# Altium schematic sheet 04-GPS.SchDoc
size A
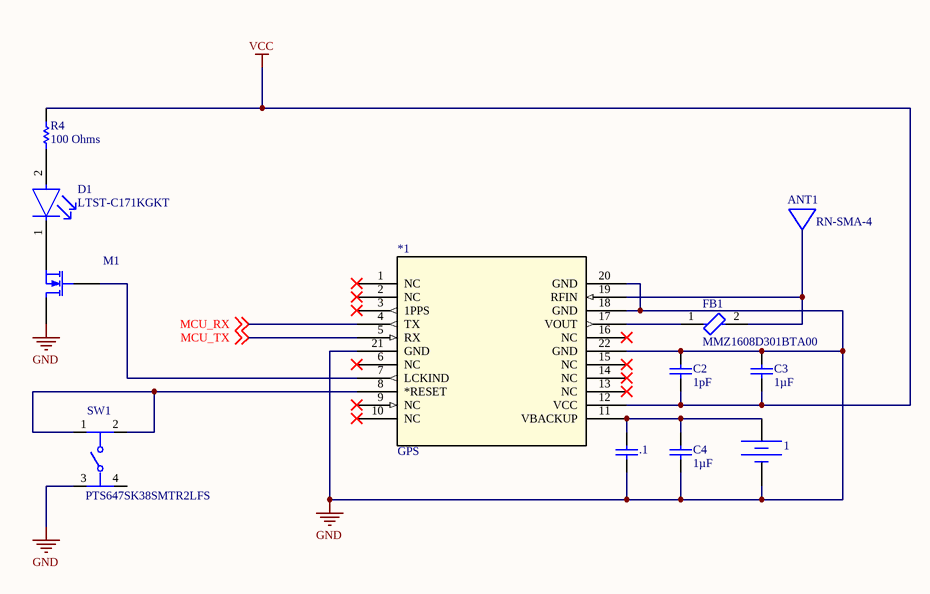
[diagram p0: 04-GPS.SchDoc]

## Parts
1  Constant Voltage Source  (value not drawn)
*1  GPS
.1  Capacitor  (value not drawn)
ANT1  RN-SMA-4  [FP-RN-SMA-4-MFG]
C2  value 1pF  (hidden comment: Capacitor)
C3  value 1µF  (hidden comment: Capacitor)
C4  value 1µF  (hidden comment: Capacitor)
D1  LTST-C171KGKT  [FP-LTST-C171KGKT-MFG]
FB1  MMZ1608D301BTA00  [FP-MMZ1608-0_8-MFG]
M1  N-chanel Power MOSFET VDMOS Model  (value not drawn)
R4  value 100 Ohms  (hidden comment: Resistor)
SW1  PTS647SK38SMTR2LFS  [FP-PTS647SK38SMTR2LFS-MFG]

## Nets
GND: 1.2 *1.18(GND) *1.20(GND) *1.21(GND) *1.22(GND) .1.1 C2.2 C3.2 C4.1 M1.1(D) SW1.3
VCC: *1.12(VCC) C2.1 C3.1 R4.2
MCU_RX: *1.4(TX) ; off-sheet MCU_RX
MCU_TX: *1.5(RX) ; off-sheet MCU_TX
Net1_1: 1.1 *1.11(VBACKUP) .1.2 C4.2
Net*1_7: *1.7(LCKIND) M1.2(G)
Net*1_8: *1.8(*RESET) SW1.1 SW1.2
Net*1_17: *1.17(VOUT) FB1.1
Net*1_19: *1.19(RFIN) FB1.2
NetD1_1: D1.1(C) M1.3(S)
NetD1_2: D1.2(A) R4.1

Not connected (* = marked no-connect by the designer): *1 1(NC)* 2(NC)* 3(1PPS)* 6(NC)* 9(NC)* 10(NC)* 13(NC)* 14(NC)* 15(NC)* 16(NC)*; SW1 4

## Library data of the parts
1 = Battery: SimulationGenericComponent: True; DC Magnitude: 5
.1 C2-C4 = Capacitor: SimulationGenericComponent: True
ANT1 = CMP-06329-000002-1: RF ANT 2.4GHZ WHIP SMA MALE 4"; Number of Bands: 1; Input Impedance: 50R; VSWR: 1.9; Bandwidth: 120MHz; Frequency: 2.45GHz; REACH SVHC: No SVHC; Height: 4.449inch; Packaging: Bulk; Case/Package: SMA; Package Quantity: 1; Lead Free: Lead Free; Series: -; Termination: SMA; Connector Type: SMA; Radiation Hardening: No; Impedance: 50R; Mount: Connector
D1 = CMP-22017-000037-1: LED GREEN CLEAR SMD; Number of LEDs: 1; Viewing Angle: 130°; Lens Style: Rectangular; Dominant Wavelength: 571nm; Test Current: 20mA; Luminous Intensity: 35mcd; Power Rating: 75mW; Forward Voltage: 2.4V; Forward Current: 30mA; Reverse Voltage: 5V; Lens Color: Colorless; Wavelength: 574nm; Height: 0.8mm; Illumination Color: Green; Length: 2mm; Case/Package: 0805; Number of Pins: 2; Number of Elements: 1; Package Quantity: 1; Depth: 1.25mm; Lens Transparency: Clear; Width: 1.25mm; Color: Green; Radiation Hardening: No; Mount: Surface Mount; Packaging: Tape and Reel; Case Code (Metric): 2012; Lead Free: Lead Free; Max Operating Temperature: 85°C; Min Operating Temperature: -55°C; Case Code (Imperial): 0805; Power Dissipation: 75mW
FB1 = CMP-08257-000452-1: Signal Line Ferrite Bead 300Ω  @ 100MHz 300mA DCR 700mΩ SMD 0603; DC Resistance (DCR): 700mR; Impedance: 300R; Case/Package: 0603; Max DC Current: 300mA; REACH SVHC: No SVHC; Case Code (Imperial): 0603; Case Code (Metric): 1608; Length: 0.063inch; Mount: Surface Mount; RoHS Compliant: Yes; Current Rating: 300mA; Packaging: Cut Tape; Width: 0.031inch; Height: 0.037inch; Package Quantity: 4000; Series: MMZ
M1 = MOSFET P-ch VDMOS: XTI: 0; A: 1; BV: 1e30; EG: 1.11; FC: 0.5; IBV: 1e-10; IS: 1e-14; PHI: 0.6; TNOM: 27; VJ: 0.8; SimulationGenericComponent: True; CGDMAX: 0; CGDMIN: 0; CGS: 0; CJO: 0; KP: 1; KSUBTHRES: 0; LAMBDA: 0; M: 0.5; MTRIODE: 1; N: 1; NBV: 1; NCHAN: 1; PCHAN: 1; RB: 0; RD: 0; RDS: 1e30; RG: 0; RQ: 0; RS: 0; SUBSHIFT: 0; SUBSLOPE: 0; THETA: 0; TT: 0; VQ: 0; VTO: 0
R4 = Resistor: TC1: 0; SimulationGenericComponent: True; TC2: 0
SW1 = CMP-10040-000033-1: TACT 4.5 X 4.5, 3.8 MM H, 2.5N,; Switch Function: Off-Mom; Switch Travel: 0.25mm; Actuator Type: Standard; Illumination Type: Non-Illuminated; Mechanical Life: 100000Cycles; Ratings: IP40; Operating Force: 250gf; Throw Configuration: SPST; Max Operating Temperature: 70°C; Min Operating Temperature: -20°C; Termination: Gull Wing; Mount: Surface Mount; Packaging: Tape and Reel